# Altium schematic sheet TAS-L3X-433UD22X_Footprint_AD.SchDoc
size 558 x 431 mm
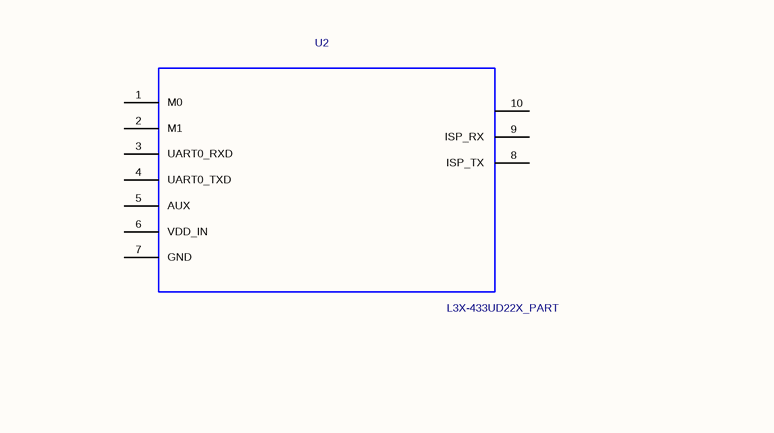
[diagram p0: TAS-L3X-433UD22X_Footprint_AD.SchDoc, bottom middle]

## Parts
U2  L3X-433UD22X_PART  [L3X-433UD22X]

## Nets

Not connected (* = marked no-connect by the designer): U2 1(M0) 2(M1) 3(UART0_RXD) 4(UART0_TXD) 5(AUX) 6(VDD_IN) 7(GND) 8(ISP_TX) 9(ISP_RX) 10

## Library data of the parts
U2 = L3X-433UD22X_PART: PCB DECAL: L3X-433UD22X